# EAGLE design TinyPICO FeatherWing (EAGLE 9.5.0)
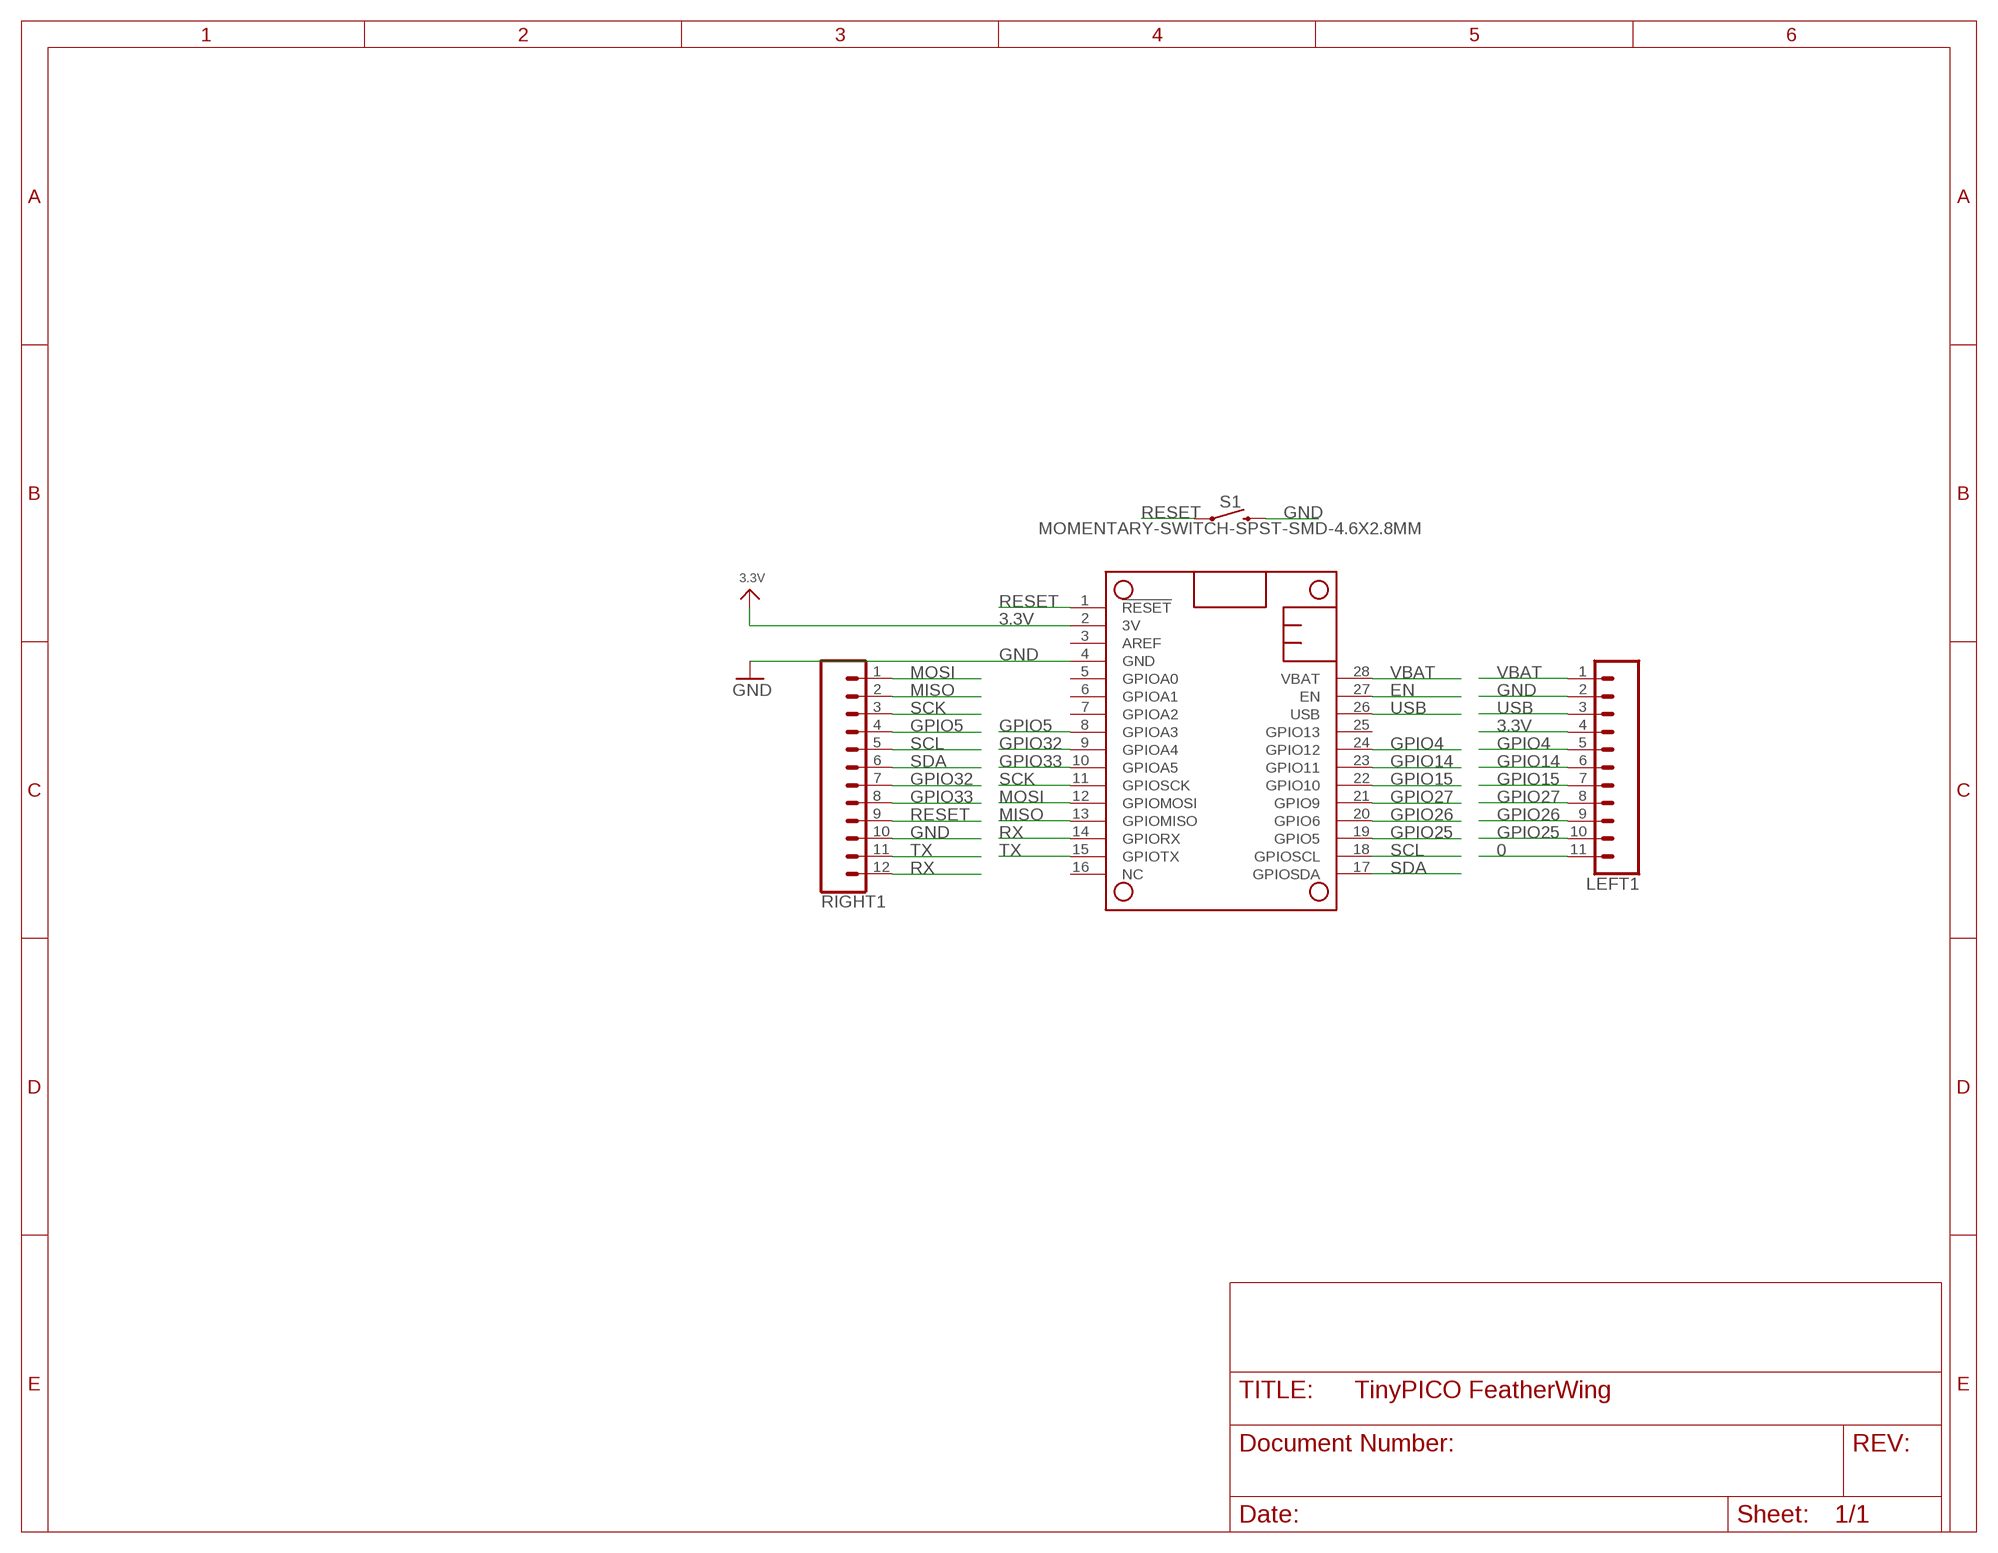
[diagram p0: schematic, sheet 1]

## Parts
LEFT1  CONN_11  [1X11]
MS2  FEATHERWING  [FEATHERWING]
RIGHT1  CONN_12  [1X12]
S1  MOMENTARY-SWITCH-SPST-SMD-4.6X2.8MM  [TACTILE_SWITCH_SMD_4.6X2.8MM]

## Nets
0: LEFT1.11
3.3V: LEFT1.4 MS2.2(3V)
EN: MS2.27(EN)
GND: LEFT1.2 MS2.4(GND) RIGHT1.10 S1.3 S1.4
GPIO4: LEFT1.5 MS2.24(GPIO12)
GPIO5: MS2.8(GPIOA3) RIGHT1.4
GPIO14: LEFT1.6 MS2.23(GPIO11)
GPIO15: LEFT1.7 MS2.22(GPIO10)
GPIO25: LEFT1.10 MS2.19(GPIO5)
GPIO26: LEFT1.9 MS2.20(GPIO6)
GPIO27: LEFT1.8 MS2.21(GPIO9)
GPIO32: MS2.9(GPIOA4) RIGHT1.7
GPIO33: MS2.10(GPIOA5) RIGHT1.8
MISO: MS2.13(GPIOMISO) RIGHT1.2
MOSI: MS2.12(GPIOMOSI) RIGHT1.1
RESET: MS2.1(!RESET) RIGHT1.9 S1.1 S1.2
RX: MS2.14(GPIORX) RIGHT1.12
SCK: MS2.11(GPIOSCK) RIGHT1.3
SCL: MS2.18(GPIOSCL) RIGHT1.5
SDA: MS2.17(GPIOSDA) RIGHT1.6
TX: MS2.15(GPIOTX) RIGHT1.11
USB: LEFT1.3 MS2.26(USB)
VBAT: LEFT1.1 MS2.28(VBAT)
Unconnected: MS2.3(AREF) MS2.5(GPIOA0) MS2.6(GPIOA1) MS2.7(GPIOA2) MS2.16(NC) MS2.25(GPIO13)

## Library data of the parts
LEFT1 = SparkFun-Connectors:CONN_11: Multi connection point. Often used as Generic Header-pin footprint for 0.1 inch spaced/style header connections On any of the 0.1 inch spaced packages, you can populate with these: Break Away Headers - Straight <https://www.sparkfun.com/products/116> (PRT-00116) Break Away Male Headers - Right Angle <https://www.sparkfun.com/products/553> (PRT-00553) Female Headers <https://www.sparkfun.com/products/115> (PRT-00115) Break Away Headers - Machine Pin <https://www.sparkfun.com/products/117> (PRT-00117) Break Away Female Headers - Swiss Machine Pin <https://www.sparkfun.com/products/743> (PRT-00743) For SCREWTERMINALS and SPRING TERMINALS visit here: Screw Terimnals on SparkFun.com <https://www.sparkfun.com/search/results?term=Screw+Terminals> (5mm/3.5mm/2.54mm spacing) This device is also useful as a general connection point to wire up your design to another part of your project. Our various solder wires solder well into these plated through hole pads. Hook-Up Wire - Assortment (Stranded, 22 AWG) <https://www.sparkfun.com/products/11375> (PRT-11375) Hook-Up Wire - Assortment (Solid Core, 22 AWG) <https://www.sparkfun.com/products/11367> (PRT-11367) View the entire wire category on our website here <https://www.sparkfun.com/categories/141>
MS2 = microbuilder:FEATHERWING
RIGHT1 = SparkFun-Connectors:CONN_12: Multi connection point. Often used as Generic Header-pin footprint for 0.1 inch spaced/style header connections On any of the 0.1 inch spaced packages, you can populate with these: Break Away Headers - Straight <https://www.sparkfun.com/products/116> (PRT-00116) Break Away Male Headers - Right Angle <https://www.sparkfun.com/products/553> (PRT-00553) Female Headers <https://www.sparkfun.com/products/115> (PRT-00115) Break Away Headers - Machine Pin <https://www.sparkfun.com/products/117> (PRT-00117) Break Away Female Headers - Swiss Machine Pin <https://www.sparkfun.com/products/743> (PRT-00743) For SCREWTERMINALS and SPRING TERMINALS visit here: Screw Terimnals on SparkFun.com <https://www.sparkfun.com/search/results?term=Screw+Terminals> (5mm/3.5mm/2.54mm spacing) This device is also useful as a general connection point to wire up your design to another part of your project. Our various solder wires solder well into these plated through hole pads. Hook-Up Wire - Assortment (Stranded, 22 AWG) <https://www.sparkfun.com/products/11375> (PRT-11375) Hook-Up Wire - Assortment (Solid Core, 22 AWG) <https://www.sparkfun.com/products/11367> (PRT-11367) View the entire wire category on our website here <https://www.sparkfun.com/categories/141> Special notes: Molex polarized connector foot print use with SKU : PRT-08231 with associated crimp pins and housings. 1MM SMD Version SKU: PRT-10208 NOTES ON THE VARIANTS LOCK and LOCK_LONGPADS... This footprint was designed to help hold the alignment of a through-hole component (i.e. 6-pin header) while soldering it into place. You may notice that each hole has been shifted either up or down by 0.005 of an inch from it's more standard position (which is a perfectly straight line). This slight alteration caused the pins (the squares in the middle) to touch the edges of the holes. Because they are alternating, it causes a "brace" to hold the component in place. 0.005 has proven to be the perfect amount of "off-center" position when using our standard breakaway headers. Although looks a little odd when you look at the bare footprint, once you have a header in there, the alteration is very hard to notice. Also,if you push a header all the way into place, it is covered up entirely on the bottom side.
S1 = SparkFun-Switches:MOMENTARY-SWITCH-SPST: Momentary Switch (Pushbutton) - SPST Normally-open (NO) SPST momentary switches (buttons, pushbuttons). Variants PTH-12MM - 12mm square, through-hole Momentary Pushbutton Switch - 12mm Square <https://www.sparkfun.com/products/9190> (COM-09190) PTH-6.0MM, PTH-6.0MM-KIT - 6.0mm square, through-hole Mini Pushbutton Switch <https://www.sparkfun.com/products/97> (COM-00097) KIT package intended for soldering kit's - only one side of pads' copper is exposed. PTH-RIGHT-ANGLE-KIT - Right-angle, through-hole Right Angle Tactile Button <https://www.sparkfun.com/products/10791> - Used on SparkFun BigTime Watch Kit <https://www.sparkfun.com/products/11734> SMD-12MM - 12mm square, surface-mount Tactile Button - SMD (12mm) <https://www.sparkfun.com/products/12993> (COM-12993) Used on SparkFun PicoBoard <https://www.sparkfun.com/products/11888> SMD-4.5MM - 4.5mm Square Trackball Switch Used on SparkFun Blackberry Trackballer Breakout <https://www.sparkfun.com/products/13169> SMD-4.6MMX2.8MM - 4.60mm x 2.80mm, surface mount Used on SparkFun SAMD21 Mini Breakout <https://www.sparkfun.com/products/13664> SMD-5.2MM, SMD-5.2-REDUNDANT - 5.2mm square, surface-mount Mini Pushbutton Switch - SMD <https://www.sparkfun.com/products/8720> (COM-08720) Used on Arduino Pro Mini <https://www.sparkfun.com/products/11114> REDUNDANT package connects both switch circuits together SMD-6.0X3.5MM - 6.0 x 3.5mm, surface mount Momentary Reset Switch SMD <https://www.sparkfun.com/products/8229> (COM-08229) SMD-6.2MM-TALL - 6.2mm square, surface mount Tactile Button - SMD (6mm) <https://www.sparkfun.com/products/12992> Used on SparkFun Digital Sandbox <https://www.sparkfun.com/products/12651> SMD-RIGHT-ANGLE - Right-angle, surface mount Used on SparkFun Block for Intel® Edison - Arduino <https://www.sparkfun.com/products/13036>; PROD_ID: SWCH-13065

## Board
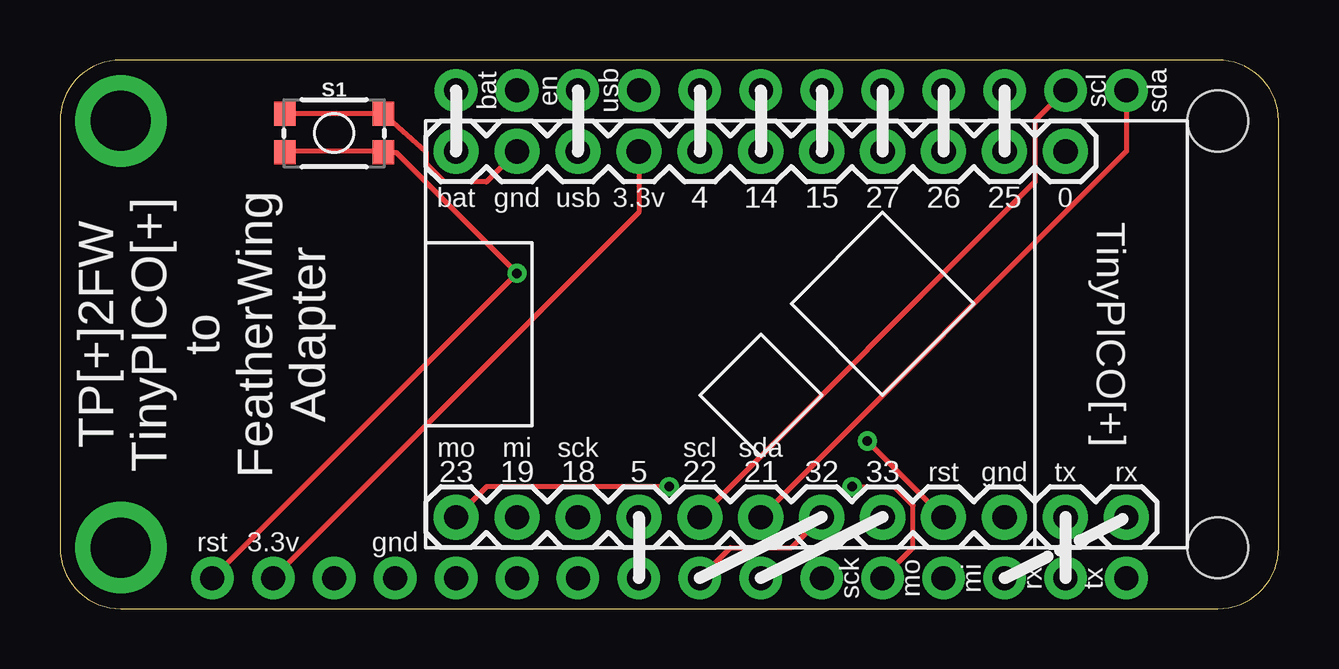
[diagram p1: board, top side]
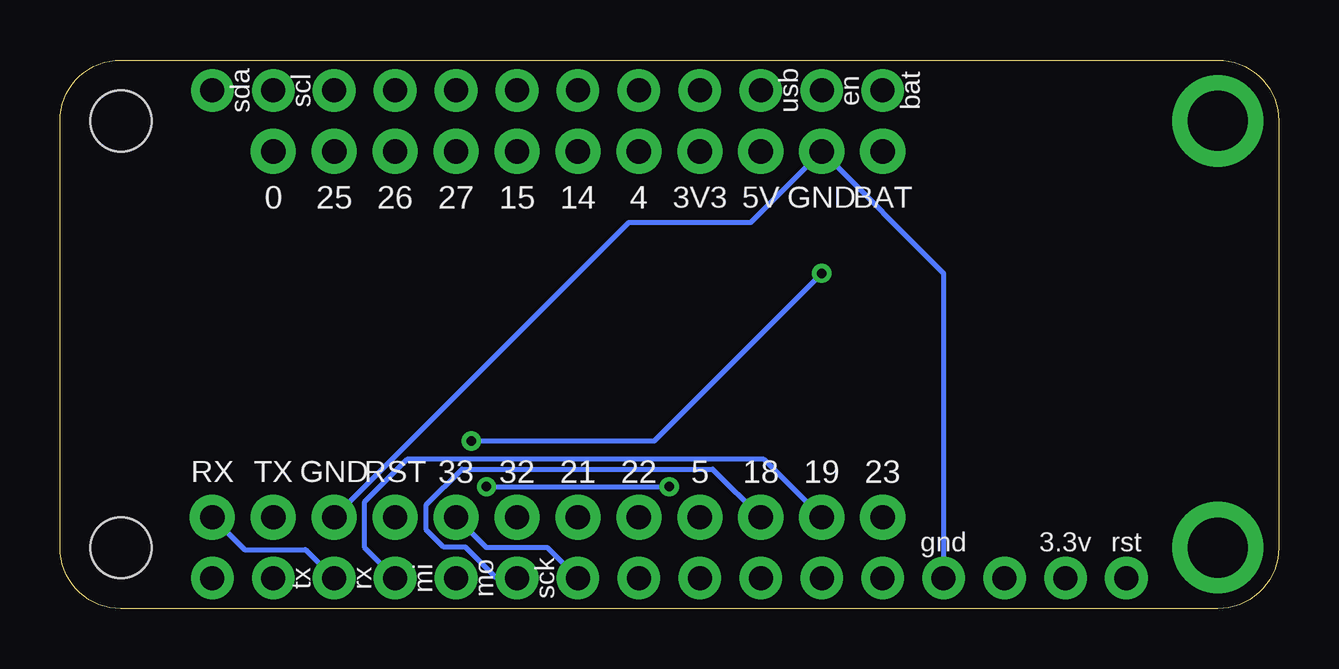
[diagram p2: board, bottom side, seen from below]

Size 50.8 x 22.86 mm. Coordinates in mm from the lower left corner, seen from the top.
Copper layers (1*16): Top 0.035mm / dielectric 1.5mm / Bottom 0.035mm
Design rules "adafruit": minimum track width 8mil, minimum drill 15.5mil, track to track 8mil, track to pad 8mil, pad to pad 8mil, via to via 8mil, smd to smd 8mil, copper to edge 10mil, drill to drill 8mil, minimum pad ring 10mil, minimum via ring 8mil, stop-mask expansion 2mil, vias tented up to drill 20mil, thermal gap 10mil

### Footprints (pad centres in the part's own frame; a part is rotated, then mirrored left to right if it is on the bottom)
1X11 = drill 1.016 pad 1.88: 1 0,0; 2 2.54,0; 3 5.08,0; 4 7.62,0; 5 10.16,0; 6 12.7,0; 7 15.24,0; 8 17.78,0; 9 20.32,0; 10 22.86,0; 11 25.4,0
FEATHERWING = drill 1 pad 1.778: 1 6.35,1.27; 2 8.89,1.27; 3 11.43,1.27; 4 13.97,1.27; 5 16.51,1.27; 6 19.05,1.27; 7 21.59,1.27; 8 24.13,1.27; 9 26.67,1.27; 10 29.21,1.27; 11 31.75,1.27; 12 34.29,1.27; 13 36.83,1.27; 14 39.37,1.27; 15 41.91,1.27; 16 44.45,1.27; 17 44.45,21.59; 18 41.91,21.59; 19 39.37,21.59; 20 36.83,21.59; 21 34.29,21.59; 22 31.75,21.59; 23 29.21,21.59; 24 26.67,21.59; 25 24.13,21.59; 26 21.59,21.59; 27 19.05,21.59; 28 16.51,21.59 | drill 2.5 pad 3.81: P$1 2.54,20.32; P$2 2.54,2.54 | hole 2.54: 48.26,20.32; 48.26,2.54
1X12 = drill 1.016 pad 1.88: 1 0,0; 2 2.54,0; 3 5.08,0; 4 7.62,0; 5 10.16,0; 6 12.7,0; 7 15.24,0; 8 17.78,0; 9 20.32,0; 10 22.86,0; 11 25.4,0; 12 27.94,0
TACTILE_SWITCH_SMD_4.6X2.8MM = smd 0.9 x 1: 1 -2.05,-0.8; 2 2.05,-0.8; 3 2.05,0.8; 4 -2.05,0.8

### Placement (x,y rotation side)
LEFT1  16.51,19.05 0 top
MS2  0,0 0 top
RIGHT1  16.51,3.81 0 top
S1  11.43,19.81 0 top

### Tracks (layer width: path | path; a pad name or v marks a point on that pad's centre or on a via)
3.3V
  Top 0.203: LEFT1.4 24.13,16.51 MS2.2
GND
  Top 0.203: LEFT1.2 17.78,17.78 17.75,17.8 15.99,17.8 15.27,18.53 15.27,19.02 15.24,19.05 S1.3 S1.4
  Bottom 0.203: RIGHT1.10 27.09,16.09 22,16.09 LEFT1.2 13.97,13.97 MS2.4
GPIO4
  Top 0.203: MS2.24 LEFT1.5
GPIO5
  Top 0.203: RIGHT1.4 MS2.8
GPIO14
  Top 0.203: MS2.23 LEFT1.6
GPIO15
  Top 0.203: MS2.22 LEFT1.7
GPIO25
  Top 0.203: MS2.19 LEFT1.10
GPIO26
  Top 0.203: MS2.20 LEFT1.9
GPIO27
  Top 0.203: MS2.21 LEFT1.8
GPIO32
  Top 0.203: MS2.9 27.94,2.54 30.48,2.54 RIGHT1.7
GPIO33
  Bottom 0.203: MS2.10 30.48,2.54 33.02,2.54 RIGHT1.8
MISO
  Bottom 0.203: RIGHT1.2 21.46,6.22 36.32,6.22 38.1,4.45 38.1,2.54 MS2.13
MOSI  (via drill 0.39)
  Top 0.203: MS2.12 35.56,2.54 35.56,4.3 34.81,5.05 33.05,5.05 v33.02,5.08 | v25.4,5.08 17.78,5.08 RIGHT1.1
  Bottom 0.203: v33.02,5.08 v25.4,5.08
RESET  (via drill 0.39)
  Top 0.203: S1.1 9.53,19.05 13.34,19.05 S1.2 14.01,19.01 v19.05,13.97 MS2.1 | RIGHT1.9 v33.66,6.99
  Bottom 0.203: v33.66,6.99 26.04,6.99 v19.05,13.97
RX
  Bottom 0.203: RIGHT1.12 43.1,2.46 40.56,2.46 MS2.14
SCK
  Bottom 0.203: MS2.11 32.6,1.27 33.9,2.56 34.81,2.56 35.53,3.29 35.53,4.33 34.04,5.82 23.6,5.82 RIGHT1.3
SCL
  Top 0.203: MS2.18 40.64,20.32 40.64,17.78 RIGHT1.5
SDA
  Top 0.203: MS2.17 44.45,19.05 RIGHT1.6
TX
  Top 0.203: RIGHT1.11 MS2.15
USB
  Top 0.203: MS2.26 LEFT1.3
VBAT
  Top 0.203: MS2.28 LEFT1.1

### Text on the board
tPlace: bat | en | usb | scl | sda | bat | gnd | usb | 3.3v | 0 | TP[+]2FW / TinyPICO[+] / to / FeatherWing / Adapter | TinyPICO[+] | mo | mi | sck | scl | sda | rst | gnd | tx | rx | rst | 3.3v | gnd | sck | mo | mi | rx | tx
bPlace: bat | en | usb | scl | sda | rst | 3.3v | gnd | sck | mo | mi | rx | tx
tNames: 4 | 14 | 15 | 27 | 26 | 25 | 23 | 19 | 18 | 5 | 22 | 21 | 32 | 33
bNames: BAT | GND | 5V | 3V3 | 4 | 14 | 15 | 27 | 26 | 25 | 0 | 23 | 19 | 18 | 5 | 22 | 21 | 32 | 33 | RST | GND | TX | RX